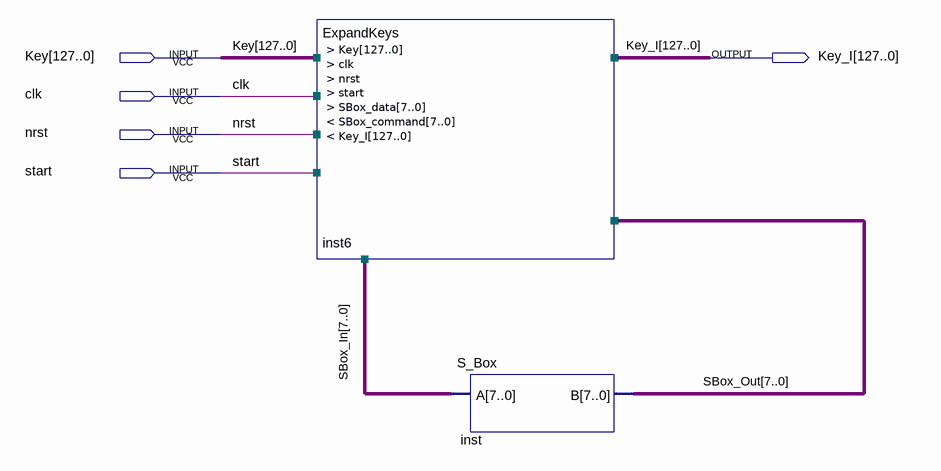
[diagram p0: schematic sheet]
// Quartus schematic KeyScheduler.bdf as structural Verilog: 2 symbols, 5 pins
module KeyScheduler (
  input  [127:0] Key,
  input  clk,
  input  nrst,
  input  start,
  output [127:0] Key_I
);

  wire [7:0] SBox_In, SBox_Out;

  ExpandKeys inst6 (
    .Key(Key), .clk(clk), .nrst(nrst), .start(start), .SBox_data(SBox_Out), .SBox_command(SBox_In),
    .Key_I(Key_I));
  S_Box inst (.A(SBox_In), .B(SBox_Out));
endmodule
